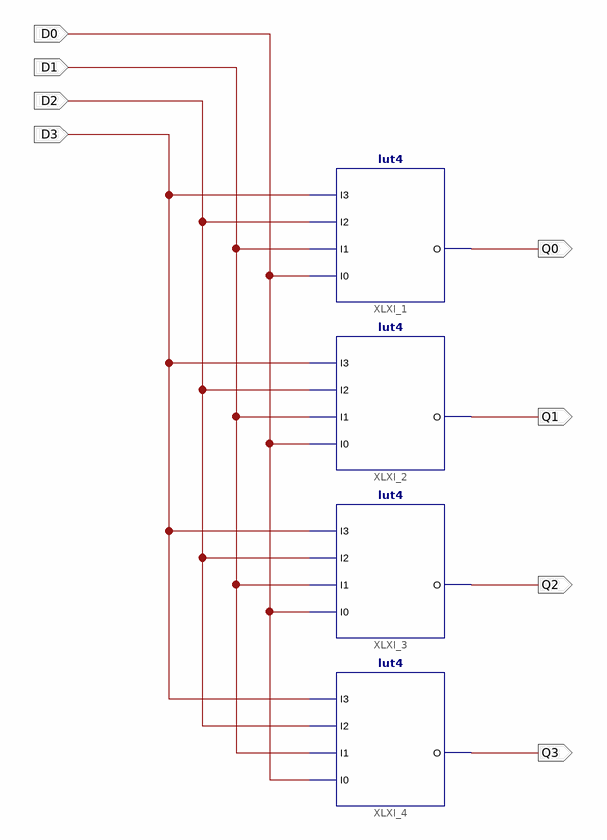
[diagram p0: schematic sheet 1]
// Xilinx ISE schematic dabblet.sch (spartan6) as structural Verilog: 4 symbols, 8 ports
module dabblet (
  input  D0,
  input  D1,
  input  D2,
  input  D3,
  output Q0,
  output Q1,
  output Q2,
  output Q3
);

  lut4 #(.INIT("014A")) XLXI_1 (.I0(D0), .I1(D1), .I2(D2), .I3(D3), .O(Q0));
  lut4 #(.INIT("018C")) XLXI_2 (.I0(D0), .I1(D1), .I2(D2), .I3(D3), .O(Q1));
  lut4 #(.INIT("0210")) XLXI_3 (.I0(D0), .I1(D1), .I2(D2), .I3(D3), .O(Q2));
  lut4 #(.INIT("03E0")) XLXI_4 (.I0(D0), .I1(D1), .I2(D2), .I3(D3), .O(Q3));
endmodule
